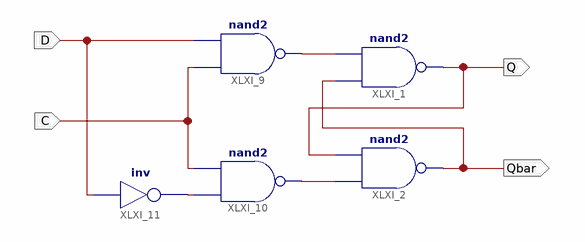
[diagram p0: schematic sheet 1]
// Xilinx ISE schematic D_Latch.sch (kintex7) as structural Verilog: 5 symbols, 4 ports
module D_Latch (
  input  C,
  input  D,
  output Qbar,
  output Q
);

  wire Dbar, XLXN_23, XLXN_24;

  nand XLXI_1 (Q, Qbar, XLXN_24);
  nand XLXI_2 (Qbar, XLXN_23, Q);
  nand XLXI_9 (XLXN_24, C, D);
  nand XLXI_10 (XLXN_23, Dbar, C);
  not XLXI_11 (Dbar, D);
endmodule
